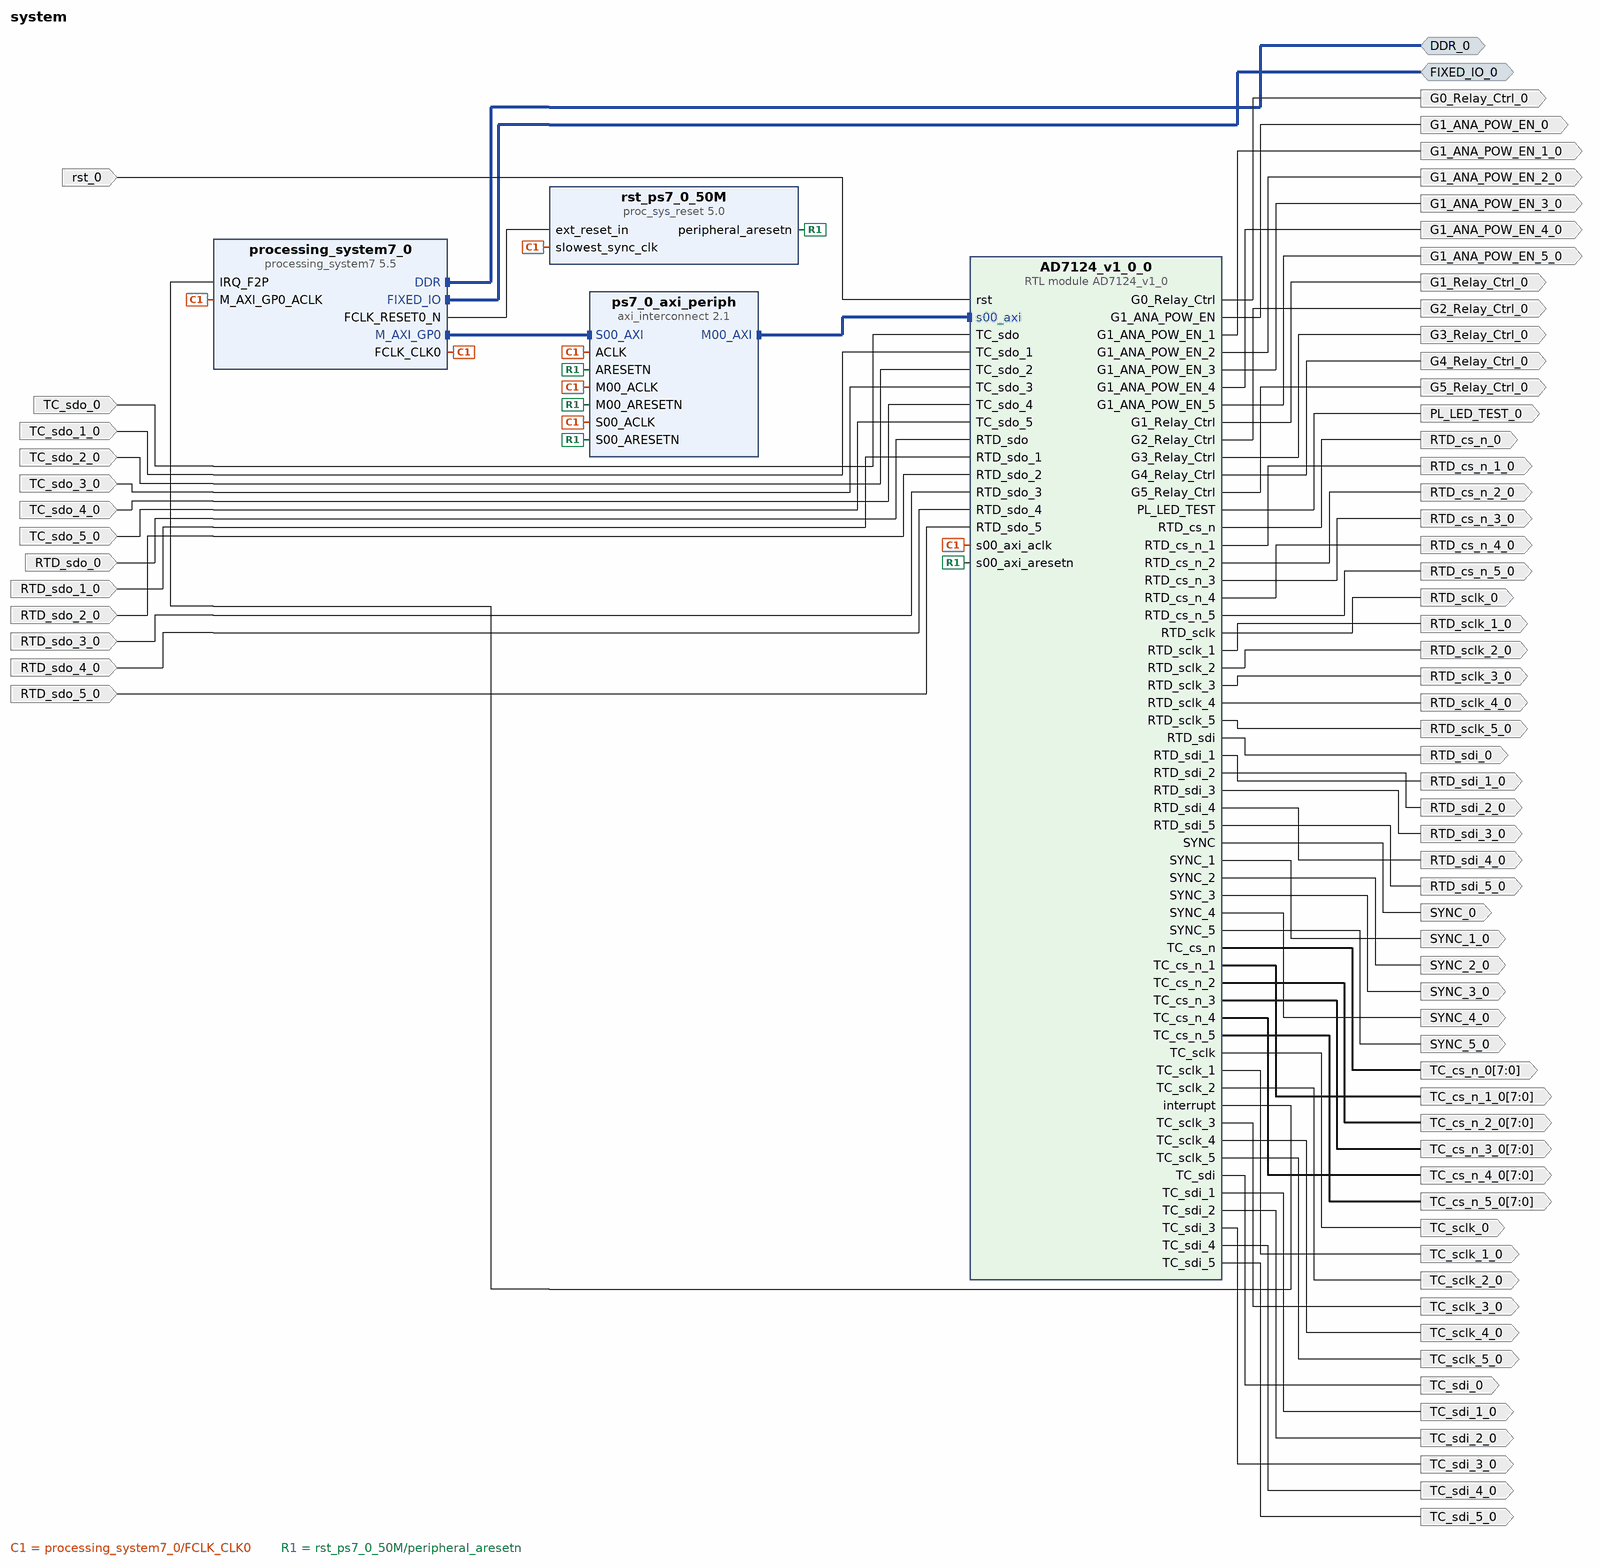
[diagram p0: block diagram of the top level]
# Vivado block design system, xc7z020clg484-1, Vivado 2020.1
create_bd_design system

create_bd_intf_port -mode Master -vlnv xilinx.com:interface:ddrx_rtl:1.0 DDR_0
create_bd_intf_port -mode Master -vlnv xilinx.com:display_processing_system7:fixedio_rtl:1.0 FIXED_IO_0
create_bd_port -dir I -type rst rst_0
create_bd_port -dir O TC_sclk_0
create_bd_port -dir O TC_sdi_0
create_bd_port -dir I TC_sdo_0
create_bd_port -dir O -from 7 -to 0 TC_cs_n_0
create_bd_port -dir O SYNC_0
create_bd_port -dir O PL_LED_TEST_0
create_bd_port -dir O G1_ANA_POW_EN_0
create_bd_port -dir I TC_sdo_2_0
create_bd_port -dir I TC_sdo_1_0
create_bd_port -dir I TC_sdo_4_0
create_bd_port -dir I TC_sdo_3_0
create_bd_port -dir I TC_sdo_5_0
create_bd_port -dir O G1_ANA_POW_EN_1_0
create_bd_port -dir O G1_ANA_POW_EN_2_0
create_bd_port -dir O G1_ANA_POW_EN_3_0
create_bd_port -dir O G1_ANA_POW_EN_4_0
create_bd_port -dir O G1_ANA_POW_EN_5_0
create_bd_port -dir O SYNC_1_0
create_bd_port -dir O SYNC_2_0
create_bd_port -dir O SYNC_3_0
create_bd_port -dir O SYNC_4_0
create_bd_port -dir O SYNC_5_0
create_bd_port -dir O -from 7 -to 0 TC_cs_n_1_0
create_bd_port -dir O -from 7 -to 0 TC_cs_n_2_0
create_bd_port -dir O -from 7 -to 0 TC_cs_n_3_0
create_bd_port -dir O -from 7 -to 0 TC_cs_n_4_0
create_bd_port -dir O -from 7 -to 0 TC_cs_n_5_0
create_bd_port -dir O TC_sclk_1_0
create_bd_port -dir O TC_sclk_2_0
create_bd_port -dir O TC_sclk_3_0
create_bd_port -dir O TC_sclk_4_0
create_bd_port -dir O TC_sclk_5_0
create_bd_port -dir O TC_sdi_1_0
create_bd_port -dir O TC_sdi_2_0
create_bd_port -dir O TC_sdi_3_0
create_bd_port -dir O TC_sdi_4_0
create_bd_port -dir O TC_sdi_5_0
create_bd_port -dir O G0_Relay_Ctrl_0
create_bd_port -dir O G1_Relay_Ctrl_0
create_bd_port -dir O G2_Relay_Ctrl_0
create_bd_port -dir O G3_Relay_Ctrl_0
create_bd_port -dir O G4_Relay_Ctrl_0
create_bd_port -dir O G5_Relay_Ctrl_0
create_bd_port -dir O RTD_cs_n_0
create_bd_port -dir O RTD_sclk_0
create_bd_port -dir O RTD_sdi_0
create_bd_port -dir I RTD_sdo_0
create_bd_port -dir O RTD_cs_n_2_0
create_bd_port -dir O RTD_sdi_3_0
create_bd_port -dir O RTD_sclk_2_0
create_bd_port -dir O RTD_cs_n_4_0
create_bd_port -dir O RTD_sdi_2_0
create_bd_port -dir O RTD_sclk_4_0
create_bd_port -dir O RTD_sdi_4_0
create_bd_port -dir O RTD_cs_n_3_0
create_bd_port -dir O RTD_sclk_3_0
create_bd_port -dir O RTD_cs_n_5_0
create_bd_port -dir O RTD_sclk_5_0
create_bd_port -dir O RTD_cs_n_1_0
create_bd_port -dir O RTD_sclk_1_0
create_bd_port -dir O RTD_sdi_1_0
create_bd_port -dir O RTD_sdi_5_0
create_bd_port -dir I RTD_sdo_4_0
create_bd_port -dir I RTD_sdo_3_0
create_bd_port -dir I RTD_sdo_5_0
create_bd_port -dir I RTD_sdo_2_0
create_bd_port -dir I RTD_sdo_1_0

create_bd_cell -type ip -vlnv xilinx.com:ip:processing_system7:5.5 processing_system7_0
set_property -dict [list \
  CONFIG.PCW_ENET0_ENET0_IO {MIO 16 .. 27} \
  CONFIG.PCW_ENET0_GRP_MDIO_ENABLE 1 \
  CONFIG.PCW_ENET0_GRP_MDIO_IO {MIO 52 .. 53} \
  CONFIG.PCW_ENET0_PERIPHERAL_ENABLE 1 \
  CONFIG.PCW_ENET0_RESET_ENABLE 0 \
  CONFIG.PCW_ENET_RESET_ENABLE 1 \
  CONFIG.PCW_ENET_RESET_SELECT {Share reset pin} \
  CONFIG.PCW_GPIO_MIO_GPIO_ENABLE 1 \
  CONFIG.PCW_GPIO_MIO_GPIO_IO MIO \
  CONFIG.PCW_I2C_RESET_ENABLE 1 \
  CONFIG.PCW_IRQ_F2P_INTR 1 \
  CONFIG.PCW_OVERRIDE_BASIC_CLOCK 1 \
  CONFIG.PCW_PRESET_BANK1_VOLTAGE {HSTL 1.8V} \
  CONFIG.PCW_QSPI_GRP_SINGLE_SS_ENABLE 1 \
  CONFIG.PCW_QSPI_GRP_SINGLE_SS_IO {MIO 1 .. 6} \
  CONFIG.PCW_QSPI_PERIPHERAL_ENABLE 1 \
  CONFIG.PCW_QSPI_QSPI_IO {MIO 1 .. 6} \
  CONFIG.PCW_SD0_GRP_CD_ENABLE 0 \
  CONFIG.PCW_SD0_GRP_WP_ENABLE 0 \
  CONFIG.PCW_SD0_PERIPHERAL_ENABLE 1 \
  CONFIG.PCW_SD0_SD0_IO {MIO 40 .. 45} \
  CONFIG.PCW_SDIO_PERIPHERAL_FREQMHZ 100 \
  CONFIG.PCW_SINGLE_QSPI_DATA_MODE x4 \
  CONFIG.PCW_UART0_PERIPHERAL_ENABLE 1 \
  CONFIG.PCW_UART0_UART0_IO {MIO 10 .. 11} \
  CONFIG.PCW_UART1_PERIPHERAL_ENABLE 1 \
  CONFIG.PCW_UART1_UART1_IO {MIO 12 .. 13} \
  CONFIG.PCW_UART_PERIPHERAL_FREQMHZ 100 \
  CONFIG.PCW_UIPARAM_DDR_PARTNO {MT41J256M16 RE-125} \
  CONFIG.PCW_USB_RESET_ENABLE 1 \
  CONFIG.PCW_USE_FABRIC_INTERRUPT 1 \
] [get_bd_cells processing_system7_0]
# 236 more settings of processing_system7_0 are not shown: defaults, MIO pin electricals, DDR timing, and values the tool derives
create_bd_cell -type ip -vlnv xilinx.com:ip:proc_sys_reset:5.0 rst_ps7_0_50M
create_bd_cell -type ip -vlnv xilinx.com:ip:axi_interconnect:2.1 ps7_0_axi_periph
set_property -dict {CONFIG.NUM_MI 1} [get_bd_cells ps7_0_axi_periph]
create_bd_cell -type module -reference AD7124_v1_0 AD7124_v1_0_0

# ---- connections ----

connect_bd_intf_net [get_bd_intf_pins AD7124_v1_0_0/s00_axi] [get_bd_intf_pins ps7_0_axi_periph/M00_AXI]
connect_bd_intf_net [get_bd_intf_pins processing_system7_0/M_AXI_GP0] [get_bd_intf_pins ps7_0_axi_periph/S00_AXI]
connect_bd_intf_net [get_bd_intf_ports DDR_0] [get_bd_intf_pins processing_system7_0/DDR]
connect_bd_intf_net [get_bd_intf_ports FIXED_IO_0] [get_bd_intf_pins processing_system7_0/FIXED_IO]
connect_bd_net [get_bd_pins processing_system7_0/FCLK_CLK0] \
  [get_bd_pins processing_system7_0/M_AXI_GP0_ACLK] [get_bd_pins rst_ps7_0_50M/slowest_sync_clk] \
  [get_bd_pins ps7_0_axi_periph/ACLK] [get_bd_pins ps7_0_axi_periph/S00_ACLK] [get_bd_pins ps7_0_axi_periph/M00_ACLK] \
  [get_bd_pins AD7124_v1_0_0/s00_axi_aclk]
connect_bd_net [get_bd_pins processing_system7_0/FCLK_RESET0_N] [get_bd_pins rst_ps7_0_50M/ext_reset_in]
connect_bd_net [get_bd_pins rst_ps7_0_50M/peripheral_aresetn] \
  [get_bd_pins ps7_0_axi_periph/ARESETN] [get_bd_pins ps7_0_axi_periph/S00_ARESETN] \
  [get_bd_pins ps7_0_axi_periph/M00_ARESETN] [get_bd_pins AD7124_v1_0_0/s00_axi_aresetn]
connect_bd_net -net rst_0_1 [get_bd_ports rst_0] [get_bd_pins AD7124_v1_0_0/rst]
connect_bd_net -net TC_sdo_0_1 [get_bd_ports TC_sdo_0] [get_bd_pins AD7124_v1_0_0/TC_sdo]
connect_bd_net -net TC_sdo_1_0_1 [get_bd_ports TC_sdo_1_0] [get_bd_pins AD7124_v1_0_0/TC_sdo_1]
connect_bd_net -net TC_sdo_2_0_1 [get_bd_ports TC_sdo_2_0] [get_bd_pins AD7124_v1_0_0/TC_sdo_2]
connect_bd_net -net TC_sdo_3_0_1 [get_bd_ports TC_sdo_3_0] [get_bd_pins AD7124_v1_0_0/TC_sdo_3]
connect_bd_net -net TC_sdo_4_0_1 [get_bd_ports TC_sdo_4_0] [get_bd_pins AD7124_v1_0_0/TC_sdo_4]
connect_bd_net -net TC_sdo_5_0_1 [get_bd_ports TC_sdo_5_0] [get_bd_pins AD7124_v1_0_0/TC_sdo_5]
connect_bd_net -net RTD_sdo_0_1 [get_bd_ports RTD_sdo_0] [get_bd_pins AD7124_v1_0_0/RTD_sdo]
connect_bd_net -net RTD_sdo_1_0_1 [get_bd_ports RTD_sdo_1_0] [get_bd_pins AD7124_v1_0_0/RTD_sdo_1]
connect_bd_net -net RTD_sdo_2_0_1 [get_bd_ports RTD_sdo_2_0] [get_bd_pins AD7124_v1_0_0/RTD_sdo_2]
connect_bd_net -net RTD_sdo_3_0_1 [get_bd_ports RTD_sdo_3_0] [get_bd_pins AD7124_v1_0_0/RTD_sdo_3]
connect_bd_net -net RTD_sdo_4_0_1 [get_bd_ports RTD_sdo_4_0] [get_bd_pins AD7124_v1_0_0/RTD_sdo_4]
connect_bd_net -net RTD_sdo_5_0_1 [get_bd_ports RTD_sdo_5_0] [get_bd_pins AD7124_v1_0_0/RTD_sdo_5]
connect_bd_net [get_bd_pins AD7124_v1_0_0/PL_LED_TEST] [get_bd_ports PL_LED_TEST_0]
connect_bd_net [get_bd_pins AD7124_v1_0_0/TC_cs_n] [get_bd_ports TC_cs_n_0]
connect_bd_net [get_bd_pins AD7124_v1_0_0/TC_sclk] [get_bd_ports TC_sclk_0]
connect_bd_net [get_bd_pins AD7124_v1_0_0/TC_sdi] [get_bd_ports TC_sdi_0]
connect_bd_net [get_bd_pins AD7124_v1_0_0/SYNC] [get_bd_ports SYNC_0]
connect_bd_net [get_bd_pins AD7124_v1_0_0/G1_ANA_POW_EN] [get_bd_ports G1_ANA_POW_EN_0]
connect_bd_net [get_bd_pins AD7124_v1_0_0/TC_cs_n_1] [get_bd_ports TC_cs_n_1_0]
connect_bd_net [get_bd_pins AD7124_v1_0_0/TC_sclk_1] [get_bd_ports TC_sclk_1_0]
connect_bd_net [get_bd_pins AD7124_v1_0_0/TC_sdi_1] [get_bd_ports TC_sdi_1_0]
connect_bd_net [get_bd_pins AD7124_v1_0_0/SYNC_1] [get_bd_ports SYNC_1_0]
connect_bd_net [get_bd_pins AD7124_v1_0_0/G1_ANA_POW_EN_1] [get_bd_ports G1_ANA_POW_EN_1_0]
connect_bd_net [get_bd_pins AD7124_v1_0_0/TC_cs_n_2] [get_bd_ports TC_cs_n_2_0]
connect_bd_net [get_bd_pins AD7124_v1_0_0/TC_sclk_2] [get_bd_ports TC_sclk_2_0]
connect_bd_net [get_bd_pins AD7124_v1_0_0/TC_sdi_2] [get_bd_ports TC_sdi_2_0]
connect_bd_net [get_bd_pins AD7124_v1_0_0/SYNC_2] [get_bd_ports SYNC_2_0]
connect_bd_net [get_bd_pins AD7124_v1_0_0/G1_ANA_POW_EN_2] [get_bd_ports G1_ANA_POW_EN_2_0]
connect_bd_net [get_bd_pins AD7124_v1_0_0/TC_cs_n_3] [get_bd_ports TC_cs_n_3_0]
connect_bd_net [get_bd_pins AD7124_v1_0_0/TC_sclk_3] [get_bd_ports TC_sclk_3_0]
connect_bd_net [get_bd_pins AD7124_v1_0_0/TC_sdi_3] [get_bd_ports TC_sdi_3_0]
connect_bd_net [get_bd_pins AD7124_v1_0_0/SYNC_3] [get_bd_ports SYNC_3_0]
connect_bd_net [get_bd_pins AD7124_v1_0_0/G1_ANA_POW_EN_3] [get_bd_ports G1_ANA_POW_EN_3_0]
connect_bd_net [get_bd_pins AD7124_v1_0_0/TC_cs_n_4] [get_bd_ports TC_cs_n_4_0]
connect_bd_net [get_bd_pins AD7124_v1_0_0/TC_sclk_4] [get_bd_ports TC_sclk_4_0]
connect_bd_net [get_bd_pins AD7124_v1_0_0/TC_sdi_4] [get_bd_ports TC_sdi_4_0]
connect_bd_net [get_bd_pins AD7124_v1_0_0/SYNC_4] [get_bd_ports SYNC_4_0]
connect_bd_net [get_bd_pins AD7124_v1_0_0/G1_ANA_POW_EN_4] [get_bd_ports G1_ANA_POW_EN_4_0]
connect_bd_net [get_bd_pins AD7124_v1_0_0/TC_cs_n_5] [get_bd_ports TC_cs_n_5_0]
connect_bd_net [get_bd_pins AD7124_v1_0_0/TC_sclk_5] [get_bd_ports TC_sclk_5_0]
connect_bd_net [get_bd_pins AD7124_v1_0_0/TC_sdi_5] [get_bd_ports TC_sdi_5_0]
connect_bd_net [get_bd_pins AD7124_v1_0_0/SYNC_5] [get_bd_ports SYNC_5_0]
connect_bd_net [get_bd_pins AD7124_v1_0_0/G1_ANA_POW_EN_5] [get_bd_ports G1_ANA_POW_EN_5_0]
connect_bd_net [get_bd_pins AD7124_v1_0_0/G0_Relay_Ctrl] [get_bd_ports G0_Relay_Ctrl_0]
connect_bd_net [get_bd_pins AD7124_v1_0_0/G1_Relay_Ctrl] [get_bd_ports G1_Relay_Ctrl_0]
connect_bd_net [get_bd_pins AD7124_v1_0_0/G2_Relay_Ctrl] [get_bd_ports G2_Relay_Ctrl_0]
connect_bd_net [get_bd_pins AD7124_v1_0_0/G3_Relay_Ctrl] [get_bd_ports G3_Relay_Ctrl_0]
connect_bd_net [get_bd_pins AD7124_v1_0_0/G4_Relay_Ctrl] [get_bd_ports G4_Relay_Ctrl_0]
connect_bd_net [get_bd_pins AD7124_v1_0_0/G5_Relay_Ctrl] [get_bd_ports G5_Relay_Ctrl_0]
connect_bd_net [get_bd_pins AD7124_v1_0_0/RTD_cs_n] [get_bd_ports RTD_cs_n_0]
connect_bd_net [get_bd_pins AD7124_v1_0_0/RTD_sclk] [get_bd_ports RTD_sclk_0]
connect_bd_net [get_bd_pins AD7124_v1_0_0/RTD_sdi] [get_bd_ports RTD_sdi_0]
connect_bd_net [get_bd_pins AD7124_v1_0_0/RTD_cs_n_1] [get_bd_ports RTD_cs_n_1_0]
connect_bd_net [get_bd_pins AD7124_v1_0_0/RTD_sclk_1] [get_bd_ports RTD_sclk_1_0]
connect_bd_net [get_bd_pins AD7124_v1_0_0/RTD_sdi_1] [get_bd_ports RTD_sdi_1_0]
connect_bd_net [get_bd_pins AD7124_v1_0_0/RTD_cs_n_2] [get_bd_ports RTD_cs_n_2_0]
connect_bd_net [get_bd_pins AD7124_v1_0_0/RTD_sclk_2] [get_bd_ports RTD_sclk_2_0]
connect_bd_net [get_bd_pins AD7124_v1_0_0/RTD_sdi_2] [get_bd_ports RTD_sdi_2_0]
connect_bd_net [get_bd_pins AD7124_v1_0_0/RTD_cs_n_3] [get_bd_ports RTD_cs_n_3_0]
connect_bd_net [get_bd_pins AD7124_v1_0_0/RTD_sclk_3] [get_bd_ports RTD_sclk_3_0]
connect_bd_net [get_bd_pins AD7124_v1_0_0/RTD_sdi_3] [get_bd_ports RTD_sdi_3_0]
connect_bd_net [get_bd_pins AD7124_v1_0_0/RTD_cs_n_4] [get_bd_ports RTD_cs_n_4_0]
connect_bd_net [get_bd_pins AD7124_v1_0_0/RTD_sclk_4] [get_bd_ports RTD_sclk_4_0]
connect_bd_net [get_bd_pins AD7124_v1_0_0/RTD_sdi_4] [get_bd_ports RTD_sdi_4_0]
connect_bd_net [get_bd_pins AD7124_v1_0_0/RTD_cs_n_5] [get_bd_ports RTD_cs_n_5_0]
connect_bd_net [get_bd_pins AD7124_v1_0_0/RTD_sclk_5] [get_bd_ports RTD_sclk_5_0]
connect_bd_net [get_bd_pins AD7124_v1_0_0/RTD_sdi_5] [get_bd_ports RTD_sdi_5_0]
connect_bd_net [get_bd_pins AD7124_v1_0_0/interrupt] [get_bd_pins processing_system7_0/IRQ_F2P]

# ---- address map ----
assign_bd_address -offset 0x43C00000 -range 64K -target_address_space [get_bd_addr_spaces processing_system7_0/Data] [get_bd_addr_segs AD7124_v1_0_0/s00_axi/reg0]

validate_bd_design
save_bd_design
